# Altium schematic sheet LED.SchDoc
size A4
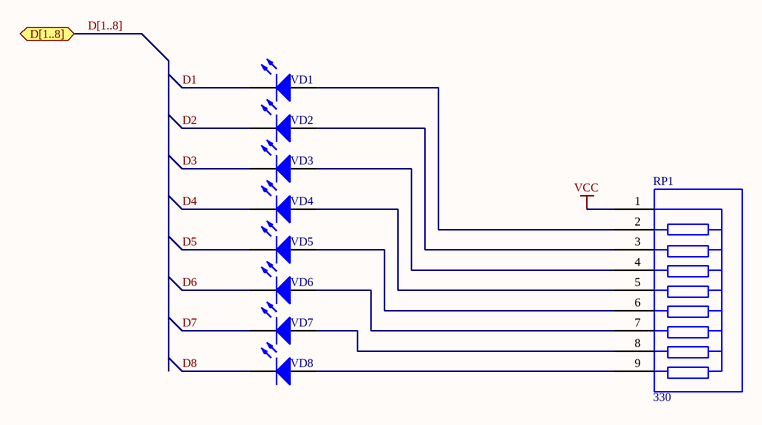
[diagram p0: LED.SchDoc]

## Parts
RP1  330  [SIP9]
VD1  BT101  [LED-5]  (value not drawn)
VD2  BT101  [LED-5]  (value not drawn)
VD3  BT101  [LED-5]  (value not drawn)
VD4  BT101  [LED-5]  (value not drawn)
VD5  BT101  [LED-5]  (value not drawn)
VD6  BT101  [LED-5]  (value not drawn)
VD7  BT101  [LED-5]  (value not drawn)
VD8  BT101  [LED-5]  (value not drawn)

## Ports
D[1..8] (bidir)

## Nets
VCC: RP1.1
D1: VD1.2(K)
D2: VD2.2(K)
D3: VD3.2(K)
D4: VD4.2(K)
D5: VD5.2(K)
D6: VD6.2(K)
D7: VD7.2(K)
D8: VD8.2(K)
NetRP1_2: RP1.2 VD1.1(A)
NetRP1_3: RP1.3 VD2.1(A)
NetRP1_4: RP1.4 VD3.1(A)
NetRP1_5: RP1.5 VD4.1(A)
NetRP1_6: RP1.6 VD5.1(A)
NetRP1_7: RP1.7 VD6.1(A)
NetRP1_8: RP1.8 VD7.1(A)
NetRP1_9: RP1.9 VD8.1(A)

## Buses and harness runs
bus D[1..8] = port D[1..8]

## Library data of the parts
RP1 = SIP-A09: Value: 330
VD1-VD8 = LED0: Typical INFRARED GaAs LED; Published: 8-Jun-2000; LatestRevisionDate: 08-Jul-2005; LatestRevisionNote: Mech Layer 1 removed.; PackageReference: LED-0; Publisher: Altium Limited; PackageDescription: LED; 2 Leads